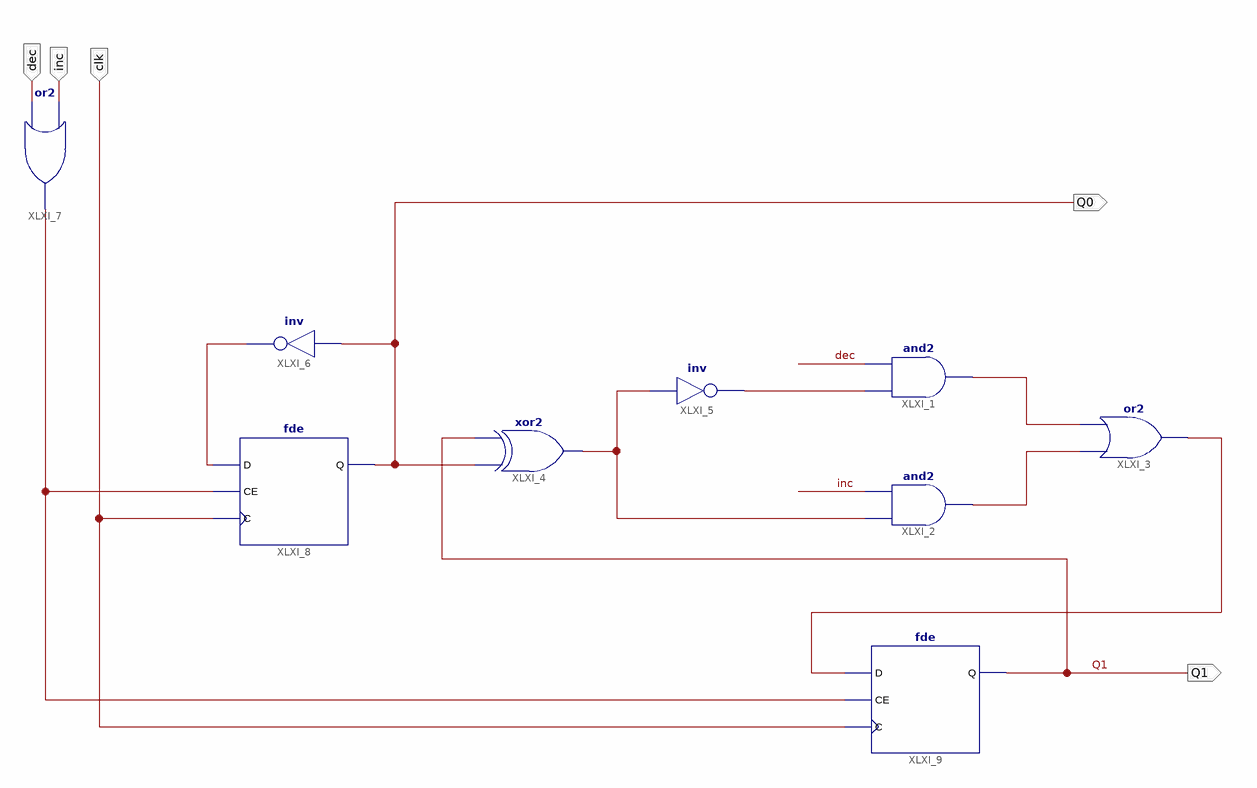
[diagram p0: schematic sheet 1]
// Xilinx ISE schematic incdec2.sch (spartan3e) as structural Verilog: 9 symbols, 5 ports
module incdec2 (
  input  dec,
  input  inc,
  input  clk,
  output Q1,
  output Q0
);

  wire XLXN_1, XLXN_2, XLXN_4, XLXN_5, XLXN_8, XLXN_14, XLXN_15;

  and XLXI_1 (XLXN_2, XLXN_1, dec);
  and XLXI_2 (XLXN_4, XLXN_8, inc);
  or XLXI_3 (XLXN_5, XLXN_4, XLXN_2);
  xor XLXI_4 (XLXN_8, Q0, Q1);
  not XLXI_5 (XLXN_1, XLXN_8);
  not XLXI_6 (XLXN_14, Q0);
  or XLXI_7 (XLXN_15, dec, inc);
  fde XLXI_8 (.C(clk), .CE(XLXN_15), .D(XLXN_14), .Q(Q0));
  fde XLXI_9 (.C(clk), .CE(XLXN_15), .D(XLXN_5), .Q(Q1));
endmodule
